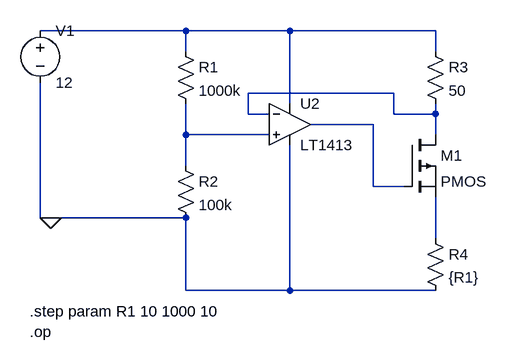
[diagram p0: schematic Draft12.asc]
Draft12.asc, the LTspice schematic file:
Version 4
SHEET 1 1056 680
WIRE 464 208 240 208
WIRE 624 208 464 208
WIRE 848 208 624 208
WIRE 464 240 464 208
WIRE 848 240 848 208
WIRE 784 304 560 304
WIRE 624 320 624 208
WIRE 560 336 560 304
WIRE 592 336 560 336
WIRE 784 336 784 304
WIRE 848 336 848 320
WIRE 848 336 784 336
WIRE 752 352 656 352
WIRE 464 368 464 320
WIRE 592 368 464 368
WIRE 848 368 848 336
WIRE 464 416 464 368
WIRE 752 448 752 352
WIRE 800 448 752 448
WIRE 240 496 240 288
WIRE 256 496 240 496
WIRE 464 496 256 496
WIRE 848 528 848 464
WIRE 464 608 464 496
WIRE 624 608 624 384
WIRE 624 608 464 608
WIRE 848 608 624 608
FLAG 256 496 0
DATAFLAG 1024 144 "$"
SYMBOL voltage 240 192 R0
SYMATTR InstName V1
SYMATTR Value 12
SYMBOL res 448 224 R0
SYMATTR InstName R1
SYMATTR Value 1000k
SYMBOL res 448 400 R0
SYMATTR InstName R2
SYMATTR Value 100k
SYMBOL res 832 224 R0
SYMATTR InstName R3
SYMATTR Value 50
SYMBOL pmos 800 368 R0
SYMATTR InstName M1
SYMBOL res 832 512 R0
SYMATTR InstName R4
SYMATTR Value {R1}
SYMBOL Opamps/LT1413 624 288 R0
SYMATTR InstName U2
TEXT 224 640 Left 2 !.step param R1 10 1000 10\n.op

The netlist it stands for:
* Draft12.asc
V1 N001 0 12
R1 N001 N004 1000k
R2 N004 0 100k
R3 N001 N002 50
M1 N002 N003 N005 N005 PMOS
R4 N005 0 {R1}
XU2 N004 N002 N001 0 N003 LT1413  ; pins In+ In- V+ V- OUT
.model NMOS NMOS
.model PMOS PMOS
.lib standard.mos
.step param R1 10 1000 10
.op
.lib LTC.lib
.backanno
.end